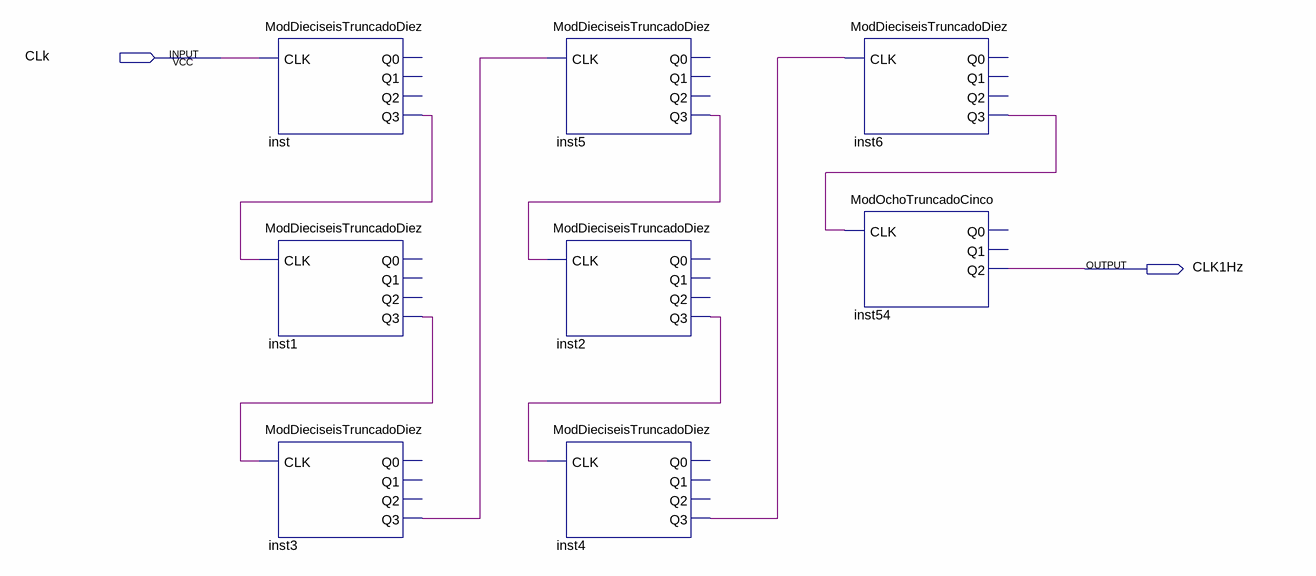
[diagram p0: schematic sheet]
// Quartus schematic DivisorFrecuencia.bdf as structural Verilog: 8 symbols, 2 pins
module DivisorFrecuencia (
  input  CLk,
  output CLK1Hz
);

  wire inst1_q3, inst2_q3, inst3_q3, inst4_q3, inst5_q3, inst6_q3, inst_q3;

  ModDieciseisTruncadoDiez inst (.CLK(CLk), .Q3(inst_q3));  // open: Q0, Q1, Q2
  ModDieciseisTruncadoDiez inst1 (.CLK(inst_q3), .Q3(inst1_q3));  // open: Q0, Q1, Q2
  ModDieciseisTruncadoDiez inst3 (.CLK(inst1_q3), .Q3(inst3_q3));  // open: Q0, Q1, Q2
  ModDieciseisTruncadoDiez inst5 (.CLK(inst3_q3), .Q3(inst5_q3));  // open: Q0, Q1, Q2
  ModDieciseisTruncadoDiez inst2 (.CLK(inst5_q3), .Q3(inst2_q3));  // open: Q0, Q1, Q2
  ModDieciseisTruncadoDiez inst4 (.CLK(inst2_q3), .Q3(inst4_q3));  // open: Q0, Q1, Q2
  ModDieciseisTruncadoDiez inst6 (.CLK(inst4_q3), .Q3(inst6_q3));  // open: Q0, Q1, Q2
  ModOchoTruncadoCinco inst54 (.CLK(inst6_q3), .Q2(CLK1Hz));  // open: Q0, Q1
endmodule
